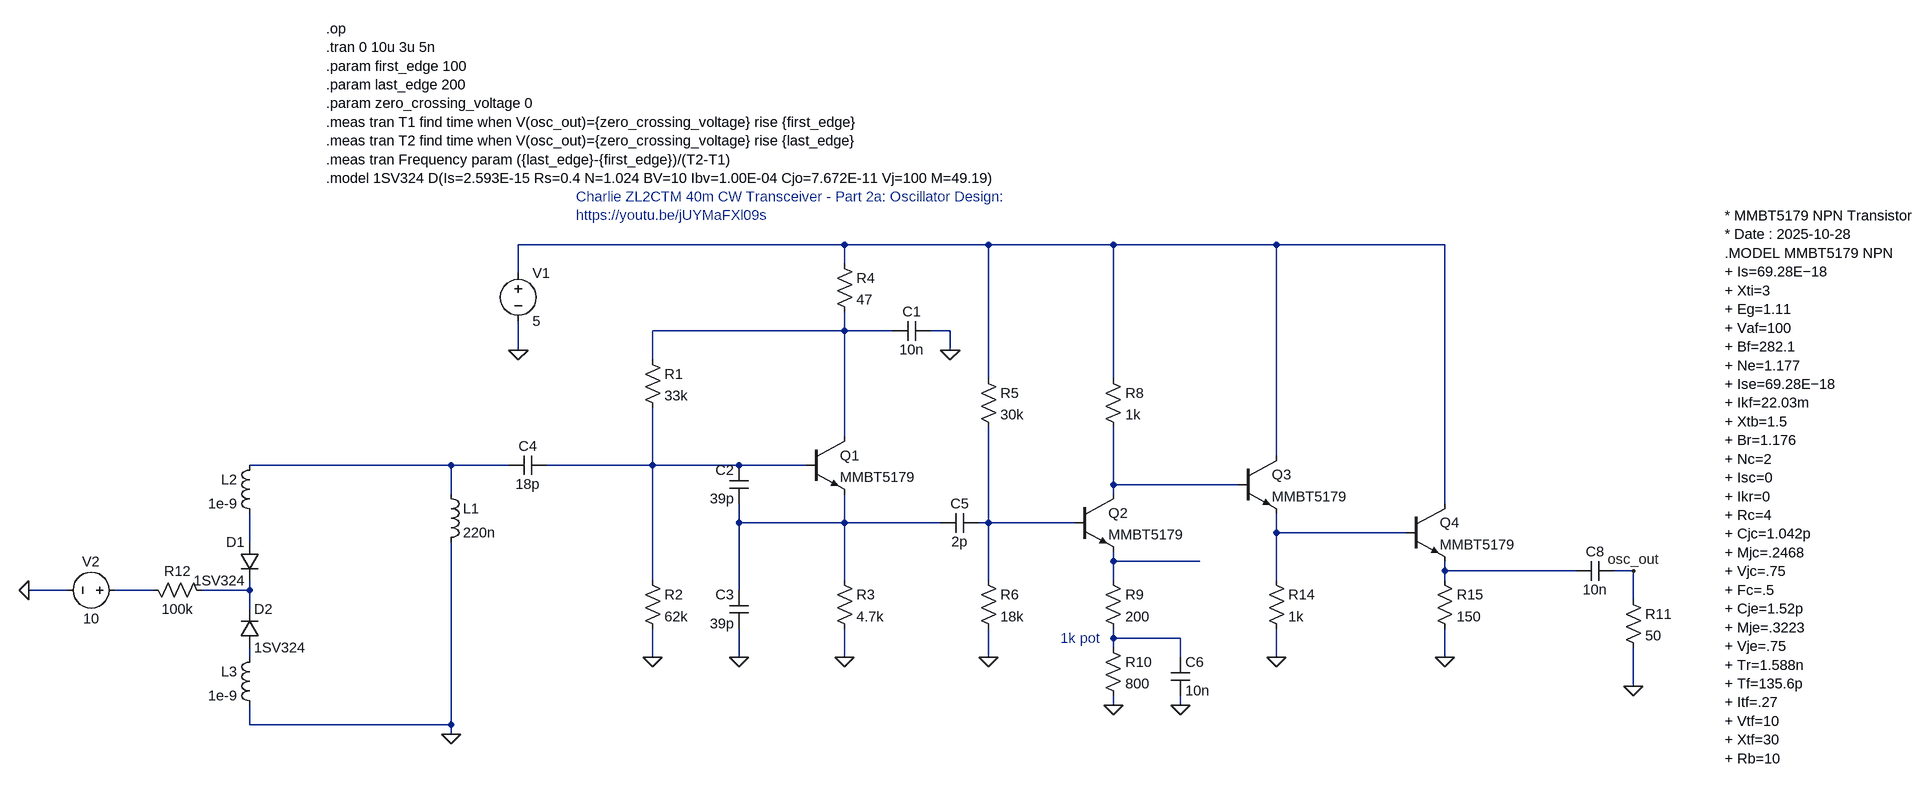
[diagram p0: schematic CC_ZL2CTM.asc]
CC_ZL2CTM.asc, the LTspice schematic file:
Version 4
SHEET 1 2472 680
WIRE 544 -736 0 -736
WIRE 784 -736 544 -736
WIRE 992 -736 784 -736
WIRE 1264 -736 992 -736
WIRE 1648 -736 1264 -736
WIRE 544 -704 544 -736
WIRE 0 -688 0 -736
WIRE 544 -592 544 -624
WIRE 544 -592 224 -592
WIRE 624 -592 544 -592
WIRE 720 -592 688 -592
WIRE 0 -560 0 -608
WIRE 720 -560 720 -592
WIRE 224 -544 224 -592
WIRE 784 -512 784 -736
WIRE 992 -512 992 -736
WIRE 544 -416 544 -592
WIRE 1264 -384 1264 -736
WIRE -112 -368 -448 -368
WIRE -16 -368 -112 -368
WIRE 224 -368 224 -464
WIRE 224 -368 48 -368
WIRE 368 -368 224 -368
WIRE 480 -368 368 -368
WIRE 992 -336 992 -432
WIRE 1200 -336 992 -336
WIRE -112 -320 -112 -368
WIRE 992 -320 992 -336
WIRE 1648 -304 1648 -736
WIRE 368 -272 368 -304
WIRE 544 -272 544 -320
WIRE 544 -272 368 -272
WIRE 704 -272 544 -272
WIRE 784 -272 784 -432
WIRE 784 -272 768 -272
WIRE 928 -272 784 -272
WIRE 1264 -256 1264 -288
WIRE 1584 -256 1264 -256
WIRE -448 -240 -448 -288
WIRE 992 -208 992 -224
WIRE 1136 -208 992 -208
WIRE 1648 -192 1648 -208
WIRE 1888 -192 1648 -192
WIRE 1984 -192 1952 -192
WIRE 224 -176 224 -368
WIRE 544 -176 544 -272
WIRE 784 -176 784 -272
WIRE 992 -176 992 -208
WIRE 1264 -176 1264 -256
WIRE 1648 -176 1648 -192
WIRE -752 -160 -816 -160
WIRE -608 -160 -672 -160
WIRE -448 -160 -448 -176
WIRE -448 -160 -528 -160
WIRE 368 -160 368 -272
WIRE 1984 -144 1984 -192
WIRE -448 -128 -448 -160
WIRE 992 -80 992 -96
WIRE 1104 -80 992 -80
WIRE 992 -64 992 -80
WIRE -448 -48 -448 -64
WIRE 224 -48 224 -96
WIRE 368 -48 368 -96
WIRE 544 -48 544 -96
WIRE 784 -48 784 -96
WIRE 1104 -48 1104 -80
WIRE 1264 -48 1264 -96
WIRE 1648 -48 1648 -96
WIRE 1984 0 1984 -64
WIRE 992 32 992 16
WIRE 1104 32 1104 16
WIRE -448 64 -448 32
WIRE -112 64 -112 -240
WIRE -112 64 -448 64
WIRE -112 80 -112 64
FLAG 0 -560 0
FLAG 224 -48 0
FLAG 368 -48 0
FLAG 544 -48 0
FLAG 720 -560 0
FLAG -112 80 0
FLAG 784 -48 0
FLAG 992 32 0
FLAG 1104 32 0
FLAG 1984 0 0
FLAG -816 -160 0
FLAG 1984 -192 osc_out
FLAG 1264 -48 0
FLAG 1648 -48 0
DATAFLAG 128 -368 ""
DATAFLAG 464 -272 ""
DATAFLAG 336 -592 ""
DATAFLAG 1104 -336 ""
DATAFLAG 784 -272 ""
DATAFLAG 1728 -192 ""
DATAFLAG 1392 -256 ""
DATAFLAG 1104 -208 ""
SYMBOL voltage 0 -704 R0
SYMATTR InstName V1
SYMATTR Value 5
SYMBOL res 208 -560 R0
SYMATTR InstName R1
SYMATTR Value 33k
SYMBOL res 208 -192 R0
SYMATTR InstName R2
SYMATTR Value 62k
SYMBOL res 528 -192 R0
SYMATTR InstName R3
SYMATTR Value 4.7k
SYMBOL res 528 -720 R0
SYMATTR InstName R4
SYMATTR Value 47
SYMBOL cap 688 -608 R90
WINDOW 0 0 32 VBottom 2
WINDOW 3 32 32 VTop 2
SYMATTR InstName C1
SYMATTR Value 10n
SYMBOL cap 384 -304 R180
WINDOW 0 24 56 Left 2
WINDOW 3 24 8 Left 2
SYMATTR InstName C2
SYMATTR Value 39p
SYMBOL cap 384 -96 R180
WINDOW 0 24 56 Left 2
WINDOW 3 24 8 Left 2
SYMATTR InstName C3
SYMATTR Value 39p
SYMBOL ind -128 -336 R0
SYMATTR InstName L1
SYMATTR Value 220n
SYMATTR SpiceLine Rser=1.17
SYMBOL npn 480 -416 R0
SYMATTR InstName Q1
SYMATTR Value MMBT5179
SYMBOL cap 48 -384 R90
WINDOW 0 0 32 VBottom 2
WINDOW 3 32 32 VTop 2
SYMATTR InstName C4
SYMATTR Value 18p
SYMBOL cap 768 -288 R90
WINDOW 0 0 32 VBottom 2
WINDOW 3 32 32 VTop 2
SYMATTR InstName C5
SYMATTR Value 2p
SYMBOL npn 928 -320 R0
SYMATTR InstName Q2
SYMATTR Value MMBT5179
SYMBOL res 768 -528 R0
SYMATTR InstName R5
SYMATTR Value 30k
SYMBOL res 768 -192 R0
SYMATTR InstName R6
SYMATTR Value 18k
SYMBOL npn 1200 -384 R0
SYMATTR InstName Q3
SYMATTR Value MMBT5179
SYMBOL res 976 -528 R0
SYMATTR InstName R8
SYMATTR Value 1k
SYMBOL res 976 -192 R0
SYMATTR InstName R9
SYMATTR Value 200
SYMBOL res 976 -80 R0
SYMATTR InstName R10
SYMATTR Value 800
SYMBOL cap 1088 -48 R0
SYMATTR InstName C6
SYMATTR Value 10n
SYMBOL cap 1952 -208 R90
WINDOW 0 0 32 VBottom 2
WINDOW 3 32 32 VTop 2
SYMATTR InstName C8
SYMATTR Value 10n
SYMBOL res 1968 -160 R0
SYMATTR InstName R11
SYMATTR Value 50
SYMBOL res -512 -144 M270
WINDOW 0 32 56 VTop 2
WINDOW 3 0 56 VBottom 2
SYMATTR InstName R12
SYMATTR Value 100k
SYMBOL voltage -656 -160 M270
WINDOW 0 32 56 VTop 2
WINDOW 3 -32 56 VBottom 2
SYMATTR InstName V2
SYMATTR Value 10
SYMBOL diode -432 -240 M0
SYMATTR InstName D1
SYMATTR Value 1SV324
SYMBOL diode -464 -64 M180
WINDOW 0 24 64 Left 2
WINDOW 3 24 0 Left 2
SYMATTR InstName D2
SYMATTR Value 1SV324
SYMBOL ind -432 -384 M0
SYMATTR InstName L2
SYMATTR Value 1e-9
SYMBOL ind -432 -64 M0
SYMATTR InstName L3
SYMATTR Value 1e-9
SYMBOL npn 1584 -304 R0
SYMATTR InstName Q4
SYMATTR Value MMBT5179
SYMBOL res 1248 -192 R0
SYMATTR InstName R14
SYMATTR Value 1k
SYMBOL res 1632 -192 R0
SYMATTR InstName R15
SYMATTR Value 150
TEXT -320 -1096 Left 2 !.op\n.tran 0 10u 3u 5n\n.param first_edge 100\n.param last_edge 200\n.param zero_crossing_voltage 0\n.meas tran T1 find time when V(osc_out)={zero_crossing_voltage} rise {first_edge}\n.meas tran T2 find time when V(osc_out)={zero_crossing_voltage} rise {last_edge}\n.meas tran Frequency param ({last_edge}-{first_edge})/(T2-T1)\n.model 1SV324 D(Is=2.593E-15 Rs=0.4 N=1.024 BV=10 Ibv=1.00E-04 Cjo=7.672E-11 Vj=100 M=49.19)
TEXT 2136 -784 Left 2 !* MMBT5179 NPN Transistor\n* Date : 2025-10-28\n.MODEL MMBT5179 NPN\n+ Is=69.28E−18 \n+ Xti=3 \n+ Eg=1.11 \n+ Vaf=100 \n+ Bf=282.1 \n+ Ne=1.177 \n+ Ise=69.28E−18 \n+ Ikf=22.03m \n+ Xtb=1.5 \n+ Br=1.176 \n+ Nc=2 \n+ Isc=0 \n+ Ikr=0 \n+ Rc=4 \n+ Cjc=1.042p \n+ Mjc=.2468 \n+ Vjc=.75 \n+ Fc=.5 \n+ Cje=1.52p \n+ Mje=.3223 \n+ Vje=.75 \n+ Tr=1.588n \n+ Tf=135.6p \n+ Itf=.27 \n+ Vtf=10 \n+ Xtf=30 \n+ Rb=10
TEXT 96 -816 Left 2 ;Charlie ZL2CTM 40m CW Transceiver - Part 2a: Oscillator Design:\nhttps://youtu.be/jUYMaFXl09s
TEXT 904 -80 Left 2 ;1k pot

The netlist it stands for:
* CC_ZL2CTM.asc
V1 N001 0 5
R1 N002 N004 33k
R2 N004 0 62k
R3 N006 0 4.7k
R4 N001 N002 47
C1 0 N002 10n
C2 N006 N004 39p
C3 0 N006 39p
L1 N003 0 220n Rser=1.17
Q1 N002 N004 N006 0 MMBT5179
C4 N004 N003 18p
C5 N007 N006 2p
Q2 N005 N007 N010 0 MMBT5179
R5 N001 N007 30k
R6 N007 0 18k
Q3 N001 N005 N008 0 MMBT5179
R8 N001 N005 1k
R9 N010 N014 200
R10 N014 0 800
C6 N014 0 10n
C8 osc_out N011 10n
R11 osc_out 0 50
R12 N013 N012 100k
V2 N012 0 10
D1 N009 N013 1SV324
D2 N015 N013 1SV324
L2 N003 N009 1e-9
L3 N015 0 1e-9
Q4 N001 N008 N011 0 MMBT5179
R14 N008 0 1k
R15 N011 0 150
.model D D
.lib standard.dio
.model NPN NPN
.model PNP PNP
.lib standard.bjt
.op
.tran 0 10u 3u 5n
.param first_edge 100
.param last_edge 200
.param zero_crossing_voltage 0
.meas tran T1 find time when V(osc_out)={zero_crossing_voltage} rise {first_edge}
.meas tran T2 find time when V(osc_out)={zero_crossing_voltage} rise {last_edge}
.meas tran Frequency param ({last_edge}-{first_edge})/(T2-T1)
.model 1SV324 D(Is=2.593E-15 Rs=0.4 N=1.024 BV=10 Ibv=1.00E-04 Cjo=7.672E-11 Vj=100 M=49.19)
* MMBT5179 NPN Transistor
* Date : 2025-10-28
.MODEL MMBT5179 NPN
+ Is=69.28E−18
+ Xti=3
+ Eg=1.11
+ Vaf=100
+ Bf=282.1
+ Ne=1.177
+ Ise=69.28E−18
+ Ikf=22.03m
+ Xtb=1.5
+ Br=1.176
+ Nc=2
+ Isc=0
+ Ikr=0
+ Rc=4
+ Cjc=1.042p
+ Mjc=.2468
+ Vjc=.75
+ Fc=.5
+ Cje=1.52p
+ Mje=.3223
+ Vje=.75
+ Tr=1.588n
+ Tf=135.6p
+ Itf=.27
+ Vtf=10
+ Xtf=30
+ Rb=10
* Charlie ZL2CTM 40m CW Transceiver - Part 2a: Oscillator Design:
* https://youtu.be/jUYMaFXl09s
* 1k pot
.backanno
.end